# EAGLE design control_system (EAGLE 9.5.1)
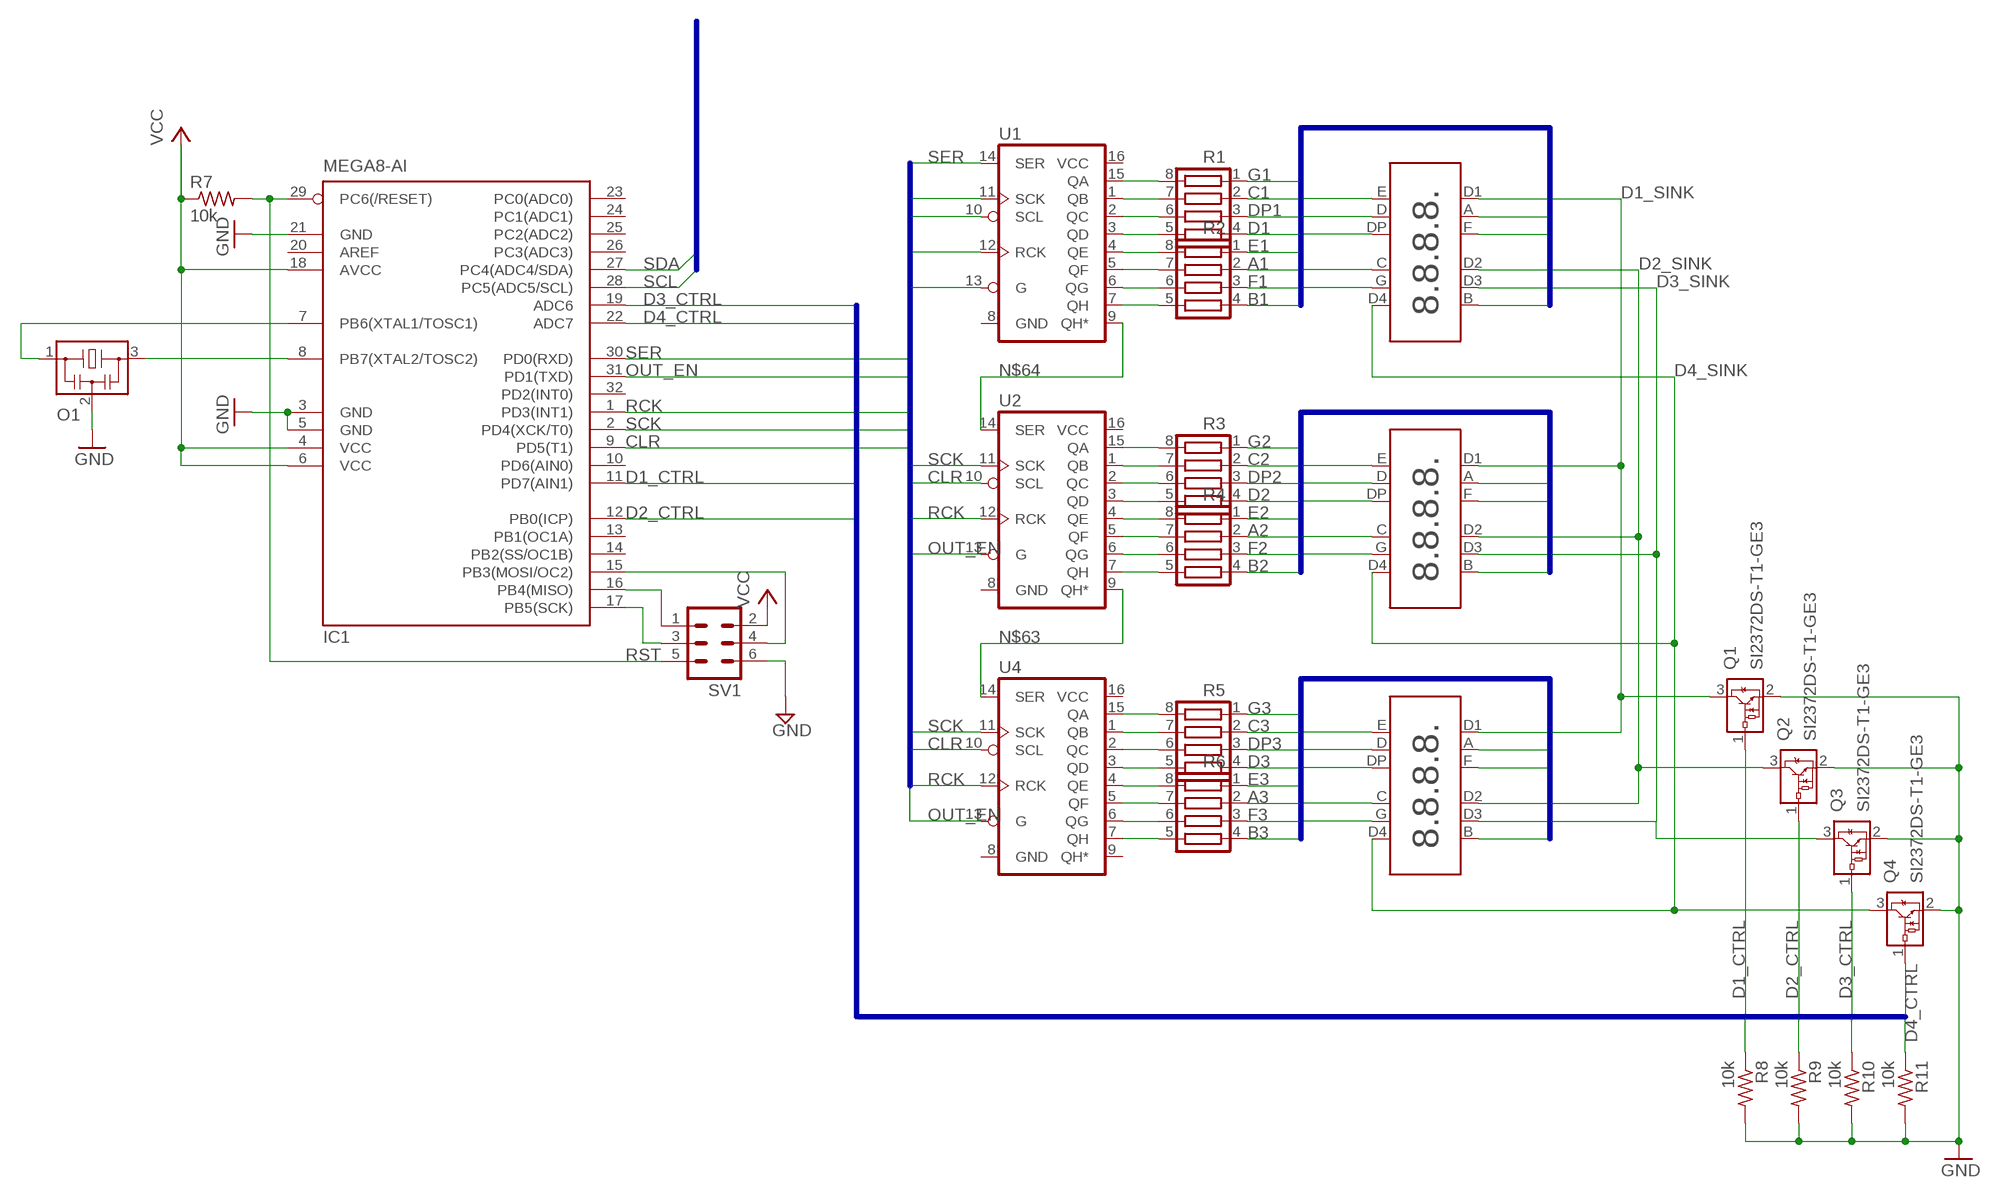
[diagram p0: schematic, sheet 1]

## Parts
IC1  MEGA8-AI  [TQFP32-08]
LED1  7SEG20MM  [7SEG20MM]
LED2  7SEG20MM  [7SEG20MM]
LED3  7SEG20MM  [7SEG20MM]
O1  CSTNE16M0V530000R0  [CSTCR6M]
Q1  SI2372DS-T1-GE3  MDC3105LT1  [SOT23]
Q2  SI2372DS-T1-GE3  MDC3105LT1  [SOT23]
Q3  SI2372DS-T1-GE3  MDC3105LT1  [SOT23]
Q4  SI2372DS-T1-GE3  MDC3105LT1  [SOT23]
R1  220  MNR04MRAPJ221MNR04  [RESCAXS50P200X150X50-8N]
R2  220  MNR04MRAPJ221MNR04  [RESCAXS50P200X150X50-8N]
R3  220  MNR04MRAPJ221MNR04  [RESCAXS50P200X150X50-8N]
R4  220  MNR04MRAPJ221MNR04  [RESCAXS50P200X150X50-8N]
R5  220  MNR04MRAPJ221MNR04  [RESCAXS50P200X150X50-8N]
R6  220  MNR04MRAPJ221MNR04  [RESCAXS50P200X150X50-8N]
R7  10k  R-US_R0402  [R0402]
R8  10k  R-US_R0402  [R0402]
R9  10k  R-US_R0402  [R0402]
R10  10k  R-US_R0402  [R0402]
R11  10k  R-US_R0402  [R0402]
SV1  MA03-2  [MA03-2]
U1  74595  [TSSOP16]
U2  74595  [TSSOP16]
U4  74595  [TSSOP16]

## Nets
A1: LED1.A R2.2
A2: LED2.A R4.2
A3: LED3.A R6.2
B1: LED1.B R2.4
B2: LED2.B R4.4
B3: LED3.B R6.4
C1: LED1.C R1.2
C2: LED2.C R3.2
C3: LED3.C R5.2
CLR: IC1.9(PD5(T1)) U1.10(SCL) U2.10(SCL) U4.10(SCL)
D1: LED1.D R1.4
D1_CTRL: IC1.11(PD7(AIN1)) Q1.1(VIN) R8.1
D1_SINK: LED1.D1 LED2.D1 LED3.D1 Q1.3(VOUT)
D2: LED2.D R3.4
D2_CTRL: IC1.12(PB0(ICP)) Q2.1(VIN) R9.1
D2_SINK: LED1.D2 LED2.D2 LED3.D2 Q2.3(VOUT)
D3: LED3.D R5.4
D3_CTRL: IC1.19(ADC6) Q3.1(VIN) R10.1
D3_SINK: LED1.D3 LED2.D3 LED3.D3 Q3.3(VOUT)
D4_CTRL: IC1.22(ADC7) Q4.1(VIN) R11.1
D4_SINK: LED1.D4 LED2.D4 LED3.D4 Q4.3(VOUT)
DP1: LED1.DP R1.3
DP2: LED2.DP R3.3
DP3: LED3.DP R5.3
E1: LED1.E R2.1
E2: LED2.E R4.1
E3: LED3.E R6.1
F1: LED1.F R2.3
F2: LED2.F R4.3
F3: LED3.F R6.3
G1: LED1.G R1.1
G2: LED2.G R3.1
G3: LED3.G R5.1
GND: IC1.3(GND) IC1.5(GND) IC1.21(GND) O1.2 Q1.2(GND) Q2.2(GND) Q3.2(GND) Q4.2(GND) R8.2 R9.2 R10.2 R11.2 SV1.6
MISO: IC1.16(PB4(MISO)) SV1.1
MOSI: IC1.15(PB3(MOSI/OC2)) SV1.4
N$1: R1.8 U1.15(QA)
N$2: R1.7 U1.1(QB)
N$3: R1.6 U1.2(QC)
N$4: R1.5 U1.3(QD)
N$5: R2.8 U1.4(QE)
N$6: R2.7 U1.5(QF)
N$7: R2.6 U1.6(QG)
N$8: R2.5 U1.7(QH)
N$17: IC1.7(PB6(XTAL1/TOSC1)) O1.1
N$18: IC1.8(PB7(XTAL2/TOSC2)) O1.3
N$23: R3.8 U2.15(QA)
N$24: R3.7 U2.1(QB)
N$25: R3.6 U2.2(QC)
N$26: R3.5 U2.3(QD)
N$27: R4.8 U2.4(QE)
N$28: R4.7 U2.5(QF)
N$29: R4.6 U2.6(QG)
N$30: R4.5 U2.7(QH)
N$43: R5.8 U4.15(QA)
N$44: R5.7 U4.1(QB)
N$45: R5.6 U4.2(QC)
N$46: R5.5 U4.3(QD)
N$47: R6.8 U4.4(QE)
N$48: R6.7 U4.5(QF)
N$49: R6.6 U4.6(QG)
N$50: R6.5 U4.7(QH)
N$63: U2.9(QH*) U4.14(SER)
N$64: U1.9(QH*) U2.14(SER)
OUT_EN: IC1.31(PD1(TXD)) U1.13(G) U2.13(G) U4.13(G)
RCK: IC1.1(PD3(INT1)) U1.12(RCK) U2.12(RCK) U4.12(RCK)
RST: IC1.29(PC6(/RESET)) R7.2 SV1.5
SCK: IC1.2(PD4(XCK/T0)) U1.11(SCK) U2.11(SCK) U4.11(SCK)
SCK1: IC1.17(PB5(SCK)) SV1.3
SCL: IC1.28(PC5(ADC5/SCL))
SDA: IC1.27(PC4(ADC4/SDA))
SER: IC1.30(PD0(RXD)) U1.14(SER)
VCC: IC1.4(VCC) IC1.6(VCC) IC1.18(AVCC) R7.1 SV1.2
Unconnected: IC1.10(PD6(AIN0)) IC1.13(PB1(OC1A)) IC1.14(PB2(SS/OC1B)) IC1.20(AREF) IC1.23(PC0(ADC0)) IC1.24(PC1(ADC1)) IC1.25(PC2(ADC2)) IC1.26(PC3(ADC3)) IC1.32(PD2(INT0)) U4.9(QH*)

## Buses
I2C:SCL,SDA
CLR,OUT_EN,RCK,SCK,SER
D1_CTRL,D2_CTRL,D3_CTRL,D4_CTRL
A1,B1,C1,D1,DP1,E1,F1,G1
A2,B2,C2,D2,DP2,E2,F2,G2
A3,B3,C3,D3,DP3,E3,F3,G3

## Power pins joined to a net without a drawn wire
GND: U1.8(GND) U2.8(GND) U4.8(GND)
VCC: U1.16(VCC) U2.16(VCC) U4.16(VCC)

## Library data of the parts
IC1 = atmel:MEGA8: MICROCONTROLLER 8 Kbytes FLASH, 1 kbytes SRAM, 512 bytes EEPROM, USART, 6-channel 10 bit ADC, 2-channel 8 bit ADC Pin compatible with Atmega48, ATMega88, ATMega168 Source: avr.lbr; MPN: ATMEGA8-16AU; OC_FARNELL: 9171371; OC_NEWARK: 73M8863
LED1-LED3 = diy-modules:7SEG20MM: 7 Segment Display, 20mm digits
O1 = murata-resonators:CSTNE16M0V530000R0
Q1-Q4 = on-semiconductor:MDC3105LT1: Integrated Relay, Inductive Load Driver Sopurce: U6 OnSemi Inductive Load Driver MDC3105-D.PDF; MF: ON SEMICONDUCTOR; MPN: MDC3105LT1; OC_FARNELL: 1126459; OC_NEWARK: 16F6132
R1-R6 = MNR04MRAPJ221:MNR04MRAPJ221
R7-R11 = rcl:R-US_: RESISTOR, American symbol; SPICEPREFIX: R
SV1 = con-lstb:MA03-2: PIN HEADER; OC_FARNELL: unknown; OC_NEWARK: unknown
U1 U2 U4 = SparkFun-IC-Logic:74*595: 8-Bit Shift Register (Serial to Parallel) Datasheet <http://cdn.sparkfun.com/datasheets/BreakoutBoards/MM74HC595.pdf> SparkFun Products SparkFun Shift Register Breakout - 74HC595 <https://www.sparkfun.com/products/10680> (BOB-10680)

## Board
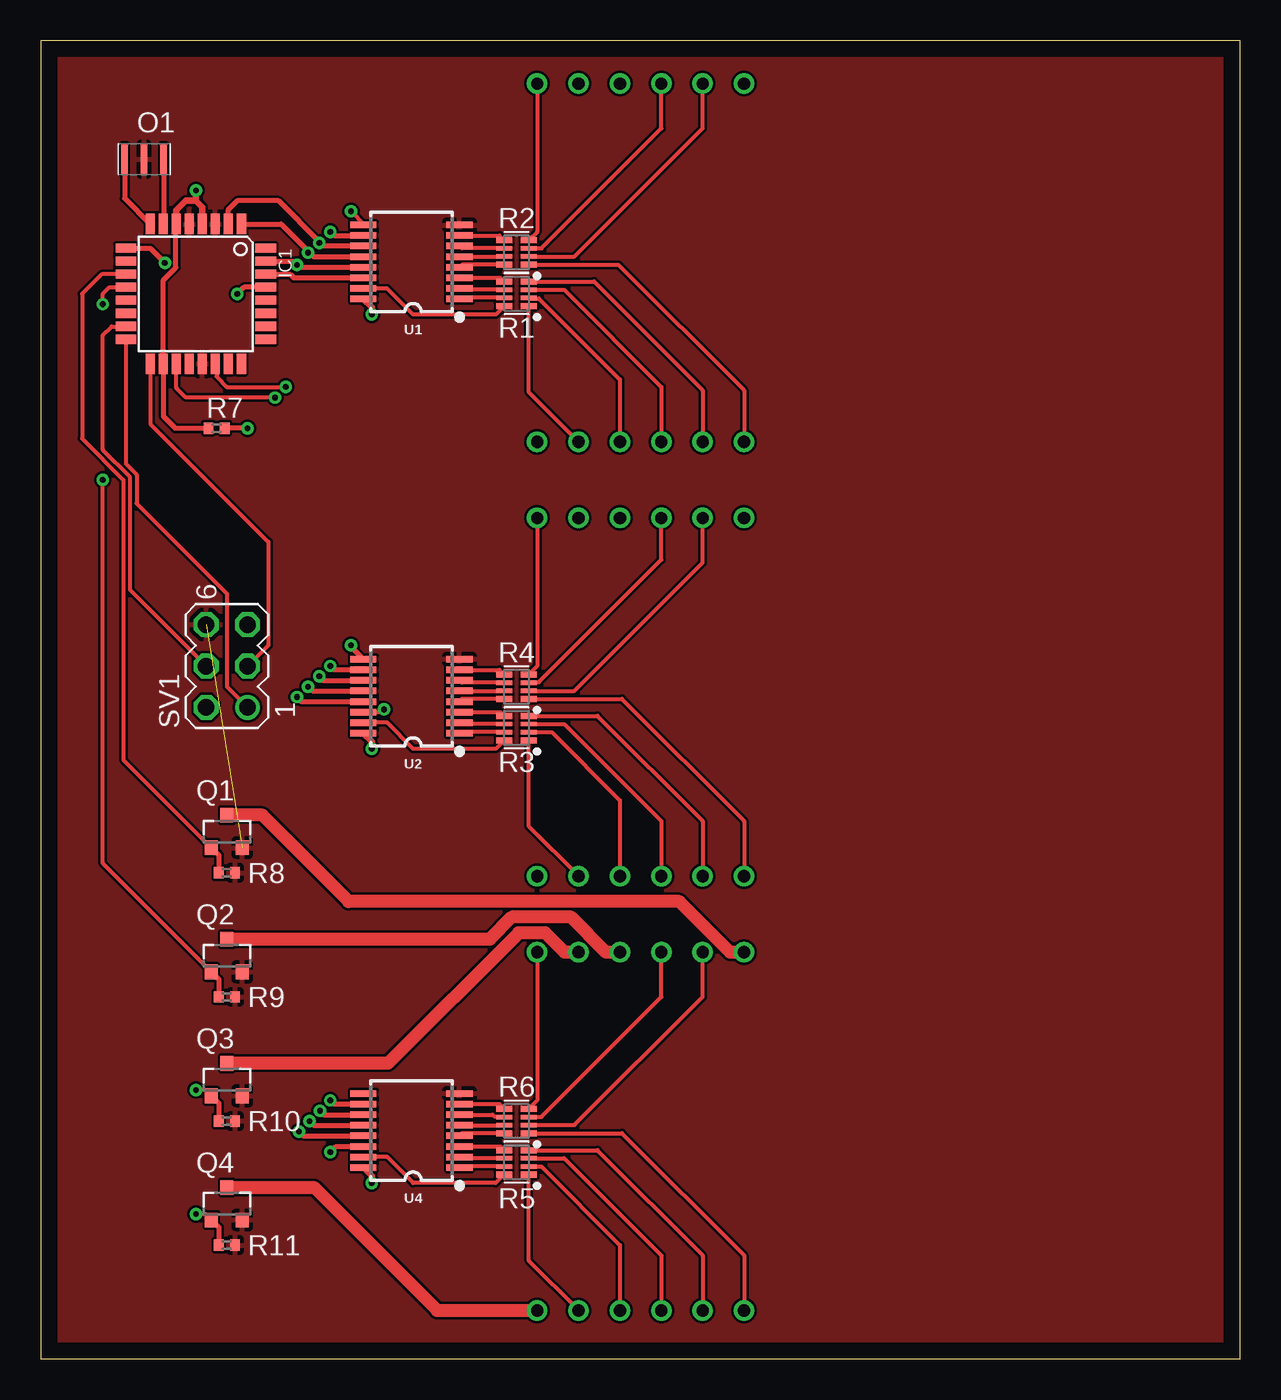
[diagram p1: board, top side]
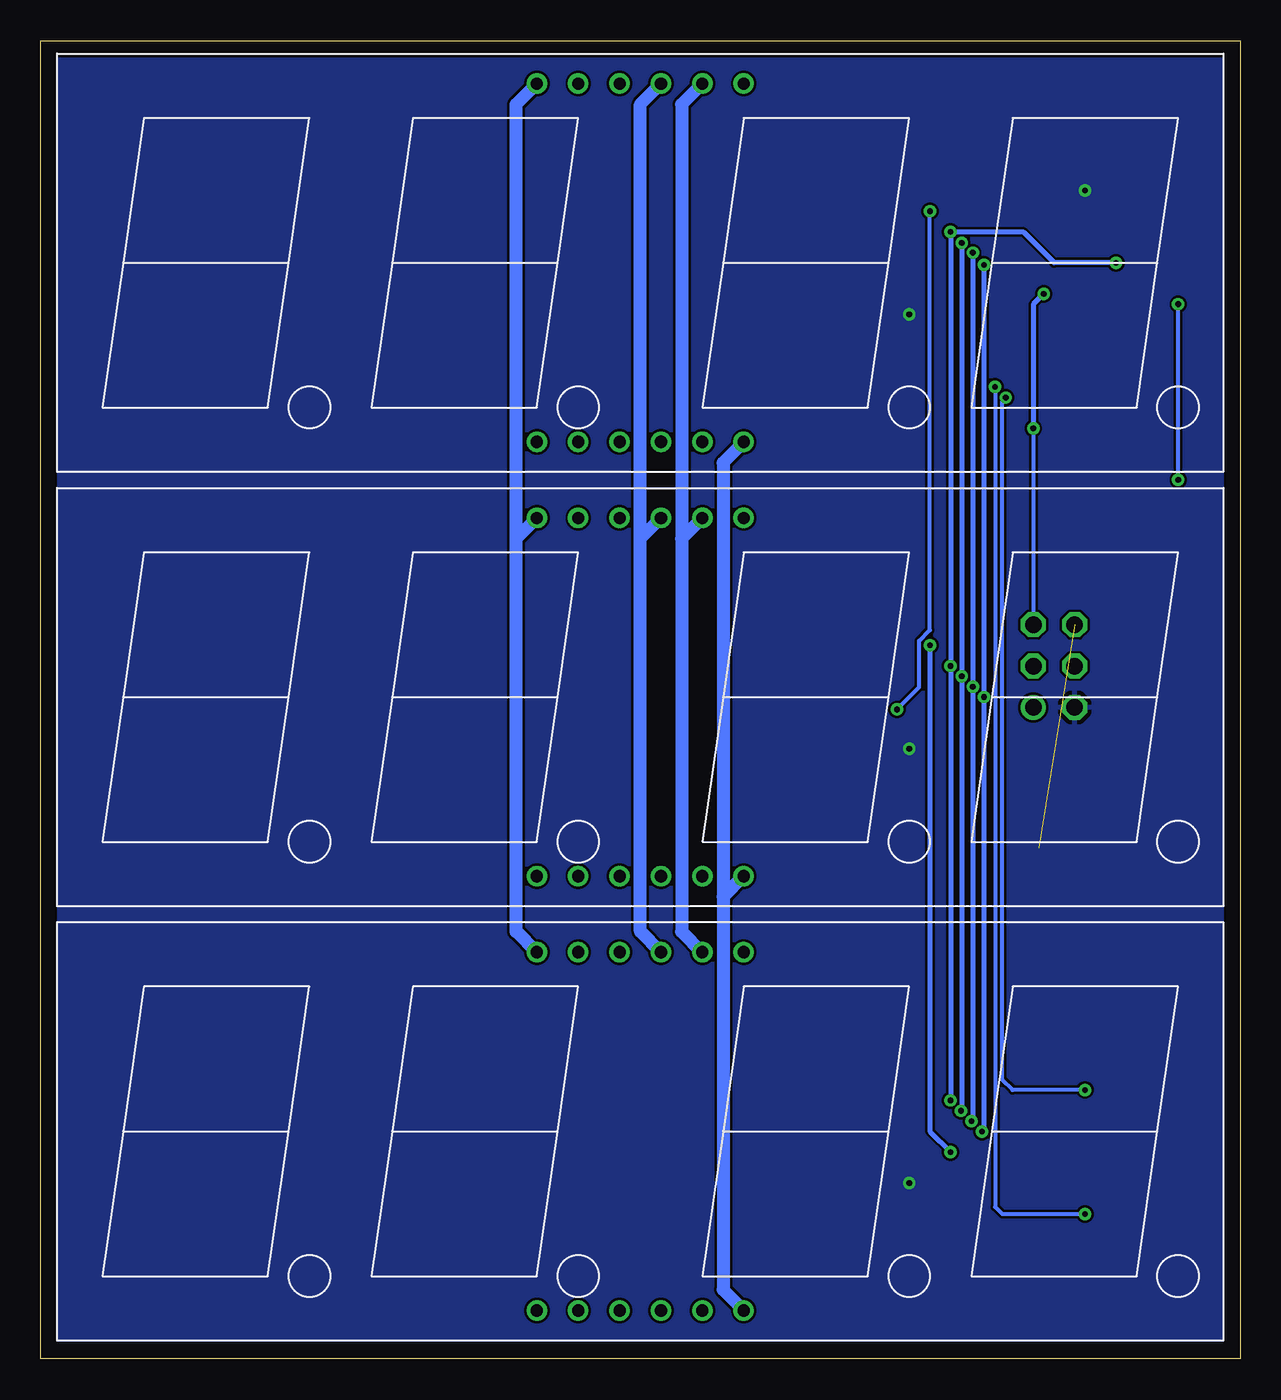
[diagram p2: board, bottom side, seen from below]

Size 73.64 x 80.95 mm. Coordinates in mm from the lower left corner, seen from the top.
Outline: 0,0 73.64,0 73.64,80.95 0,80.95 0,0
Copper layers (1*16): Top 0.035mm / dielectric 1.5mm / Bottom 0.035mm
Design rules "default": minimum track width 6mil, minimum drill 0.35mm, track to track 6mil, track to pad 6mil, pad to pad 6mil, via to via 6mil, smd to smd 6mil, copper to edge 40mil, drill to drill 6mil, minimum pad ring 10mil, minimum via ring 8mil, stop-mask expansion 4mil, vias tented up to drill 0mil, thermal gap 10mil

### Footprints (pad centres in the part's own frame; a part is rotated, then mirrored left to right if it is on the bottom)
TQFP32-08 = smd 1.27 x 0.559: 1 -4.293,2.8; 2 -4.293,2; 3 -4.293,1.2; 4 -4.293,0.4; 5 -4.293,-0.4; 6 -4.293,-1.2; 7 -4.293,-2; 8 -4.293,-2.8; 17 4.293,-2.8; 18 4.293,-2; 19 4.293,-1.2; 20 4.293,-0.4; 21 4.293,0.4; 22 4.293,1.2; 23 4.293,2; 24 4.293,2.8 | smd 0.559 x 1.27: 9 -2.8,-4.293; 10 -2,-4.293; 11 -1.2,-4.293; 12 -0.4,-4.293; 13 0.4,-4.293; 14 1.2,-4.293; 15 2,-4.293; 16 2.8,-4.293; 25 2.8,4.293; 26 2,4.293; 27 1.2,4.293; 28 0.4,4.293; 29 -0.4,4.293; 30 -1.2,4.293; 31 -2,4.293; 32 -2.8,4.293
7SEG20MM = drill 0.75: A -3.81,11; B 6.35,11; C 1.27,-11; D -3.81,-11; D1 -6.35,11; D2 1.27,11; D3 3.81,11; D4 6.35,-11; DP -1.27,-11; E -6.35,-11; F -1.27,11; G 3.81,-11
CSTCR6M = smd 0.4 x 1.9: 1 -1.2,0; 2 0,0; 3 1.2,0
SOT23 = smd 0.8 x 0.9: 1 -0.95,-1; 2 0.95,-1; 3 0,1
RESCAXS50P200X150X50-8N = smd 0.992 x 0.372: 1 -0.76,0.75; 4 -0.76,-0.75; 5 0.76,-0.75; 8 0.76,0.75 | smd 0.992 x 0.272: 2 -0.76,0.25; 3 -0.76,-0.25; 6 0.76,-0.25; 7 0.76,0.25
R0402 = smd 0.6 x 0.7: 1 -0.5,0; 2 0.5,0
MA03-2 = drill 1.016: 1 -2.54,-1.27 | drill 1.016 octagon: 2 -2.54,1.27; 3 0,-1.27; 4 0,1.27; 5 2.54,-1.27; 6 2.54,1.27
TSSOP16 = smd 0.4 x 1.6: 1 -2.225,-2.85; 2 -1.575,-2.85; 3 -0.925,-2.85; 4 -0.275,-2.85; 5 0.375,-2.85; 6 1.025,-2.85; 7 1.675,-2.85; 8 2.325,-2.85; 9 2.325,3.05; 10 1.675,3.05; 11 1.025,3.05; 12 0.375,3.05; 13 -0.275,3.05; 14 -0.925,3.05; 15 -1.575,3.05; 16 -2.225,3.05

### Placement (x,y rotation side)
IC1  9.53,65.41 270 top
LED1  36.83,67.31 0 bottom
LED2  36.83,40.64 0 bottom
LED3  36.83,13.97 0 bottom
O1  6.35,73.66 180 top
Q1  11.43,32.38 0 top
Q2  11.43,24.77 0 top
Q3  11.43,17.14 0 top
Q4  11.43,9.53 0 top
R1  29.21,65.41 180 top
R2  29.21,67.94 180 top
R3  29.21,38.73 180 top
R4  29.21,41.27 180 top
R5  29.21,12.06 180 top
R6  29.21,14.61 180 top
R7  10.79,57.15 0 top
R8  11.43,29.84 0 top
R9  11.43,22.23 0 top
R10  11.43,14.61 0 top
R11  11.43,6.99 0 top
SV1  11.43,42.55 90 top
U1  22.86,67.31 90 top
U2  22.86,40.64 90 top
U4  22.86,13.97 90 top

### Tracks (layer width: path | path; a pad name or v marks a point on that pad's centre or on a via)
A1
  Top 0.254: R2.2 32.77,67.69 40.64,75.56 LED1.A
A2
  Top 0.254: R4.2 32.77,41.02 40.64,48.9 LED2.A
A3
  Top 0.254: R6.2 32.77,14.36 40.64,22.23 LED3.A
B1
  Top 0.254: LED1.B 30.48,69.2 R2.4
B2
  Top 0.254: LED2.B 30.48,42.53 R4.4
B3
  Top 0.254: LED3.B 30.48,15.87 R6.4
C1
  Top 0.254: R1.2 30,65.12 30.58,65.12 35.56,60.14 LED1.C
C2
  Top 0.254: R3.2 31.36,38.48 35.56,34.29 LED2.C
C3
  Top 0.254: R5.2 30.73,11.81 35.56,6.99 LED3.C
CLR  (via drill 0.35)
  Top 0.305: IC1.9 6.72,68.2 v7.62,67.31 | U1.10 18.01,68.98 v17.78,69.22 | v17.78,15.88 18.01,15.64 U4.10 | U2.10 18.01,42.31 v17.78,42.55
  Bottom 0.305: v7.62,67.31 11.43,67.31 13.34,69.22 v17.78,69.22 v17.78,42.55 v17.78,15.88
D1
  Top 0.254: R1.4 33.97,66.16 40.64,59.48 LED1.D
D1_CTRL
  Top 0.254: IC1.11 3.74,66.61 2.54,65.41 2.54,56.52 5.08,53.98 5.08,36.78 Q1.1
  Top 0.305: Q1.1 10.93,30.93 R8.1
D1_SINK
  Top 0.813: LED3.D1 42.32,24.97 39.2,28.09 18.9,28.09 13.61,33.38 Q1.3
  Bottom 0.813: LED3.D1 44.45,26.24 44.45,50.37 | LED1.D1 44.45,77.04 44.45,50.37 | LED2.D1 44.45,50.37
D2
  Top 0.254: R3.4 34.17,39.48 40.64,33.02 LED2.D
D2_CTRL  (via drill 0.35)
  Top 0.254: Q2.1 3.81,30.43 v3.81,53.98 | v3.81,64.77 3.81,65.41 4.21,65.81 IC1.12
  Top 0.305: Q2.1 10.93,23.32 R9.1
  Bottom 0.254: v3.81,53.98 v3.81,64.77
D2_SINK
  Top 0.813: LED3.D2 34.7,24.97 32.55,27.12 28.93,27.12 27.57,25.77 Q2.3
  Bottom 0.813: LED3.D2 36.83,26.24 36.83,50.37 | LED1.D2 36.83,77.04 36.83,50.37 | LED2.D2 36.83,50.37
D3
  Top 0.254: R5.4 34.17,12.81 40.64,6.35 LED3.D
D3_CTRL  (via drill 0.35)
  Top 0.254: Q3.1 10.12,16.51 v9.53,16.51 | v14.39,59.03 8.91,59.03 8.32,59.62 IC1.19
  Top 0.305: Q3.1 10.93,15.7 R10.1
  Bottom 0.254: v9.53,16.51 13.97,16.51 14.61,17.14 14.61,58.82 v14.39,59.03
D3_SINK
  Top 0.813: LED3.D3 32.16,24.97 30.97,26.16 29.33,26.16 21.32,18.14 Q3.3
  Bottom 0.813: LED1.D3 34.29,77.04 34.29,50.37 | LED3.D3 34.29,26.24 34.29,50.37 | LED2.D3 34.29,50.37
D4_CTRL  (via drill 0.35)
  Top 0.254: IC1.22 10.79,61.04 10.79,60.33 11.43,59.69 v15.05,59.69 | v9.53,8.89 10.12,8.89 Q4.1
  Top 0.305: Q4.1 10.93,8.07 R11.1
  Bottom 0.254: v15.05,59.69 15.05,9.33 14.61,8.89 v9.53,8.89
D4_SINK
  Top 0.813: Q4.3 16.78,10.53 24.34,2.97 LED3.D4
  Bottom 0.813: LED1.D4 31.75,55.04 31.75,28.37 | LED3.D4 31.75,4.24 31.75,28.37 | LED2.D4 31.75,28.37
DP1
  Top 0.254: R1.3 32.13,65.66 38.1,59.69 LED1.DP
DP2
  Top 0.254: R3.3 32.13,38.98 38.1,33.02 LED2.DP
DP3
  Top 0.254: R5.3 32.13,12.31 38.1,6.35 LED3.DP
E1
  Top 0.254: R2.1 35.47,67.19 43.18,59.48 LED1.E
E2
  Top 0.254: R4.1 35.67,40.52 43.18,33.02 LED2.E
E3
  Top 0.254: R6.1 35.67,13.86 43.18,6.35 LED3.E
F1
  Top 0.254: R2.3 30.73,68.19 38.1,75.56 LED1.F
F2
  Top 0.254: R4.3 30,41.56 30.58,41.56 38.1,49.08 LED2.F
F3
  Top 0.254: R6.3 30.73,14.86 38.1,22.23 LED3.F
G1
  Top 0.254: LED1.G 29.97,59.36 R1.1
G2
  Top 0.254: LED2.G 29.97,32.69 R3.1
G3
  Top 0.254: LED3.G 29.97,6.02 R5.1
GND  (1 unrouted)
  pour Top: -1.27,81.92 -1.27,-1.27 76.2,-1.27 76.2,81.92 75.56,82.55 -0.64,82.55
MISO
  Top 0.254: IC1.16 5.23,54.97 5.89,54.31 5.89,52.53 11.43,46.99 11.43,41.27 SV1.1
MOSI
  Top 0.254: SV1.4 5.49,47.22 5.49,54.14 3.81,55.82 3.81,62.87 4.35,63.41 IC1.15
N$1
  Top 0.254: R1.8 27.93,64.14 22.86,64.14 21.26,65.73 U1.15
N$2
  Top 0.254: R1.7 25.78,65.16 U1.1
N$3
  Top 0.254: R1.6 25.79,65.66 U1.2
N$4
  Top 0.254: U1.3 28.22,66.39 R1.5
N$5
  Top 0.254: R2.8 25.87,67.19 U1.4
N$6
  Top 0.254: U1.5 R2.7
N$7
  Top 0.254: R2.6 25.85,68.19 U1.6
N$8
  Top 0.254: U1.7 28.16,68.98 R2.5
N$17
  Top 0.305: O1.1 7.55,69.72 IC1.7
N$18
  Top 0.305: O1.3 5.15,71.27 IC1.8
N$23
  Top 0.254: R3.8 27.93,37.47 22.86,37.47 21.26,39.06 U2.15
N$24
  Top 0.254: R3.7 25.78,38.48 U2.1
N$25
  Top 0.254: R3.6 25.79,38.98 U2.2
N$26
  Top 0.254: U2.3 28.22,39.72 R3.5
N$27
  Top 0.254: R4.8 25.87,40.52 U2.4
N$28
  Top 0.254: U2.5 R4.7
N$29
  Top 0.254: R4.6 25.85,41.52 U2.6
N$30
  Top 0.254: U2.7 28.16,42.31 R4.5
N$43
  Top 0.254: R5.8 27.93,10.79 22.86,10.79 21.26,12.39 U4.15
N$44
  Top 0.254: R5.7 25.78,11.81 U4.1
N$45
  Top 0.254: R5.6 25.79,12.31 U4.2
N$46
  Top 0.254: U4.3 28.22,13.04 R5.5
N$47
  Top 0.254: R6.8 25.87,13.86 U4.4
N$48
  Top 0.254: U4.5 28.44,14.35 R6.7
N$49
  Top 0.254: U4.6 27.73,14.99 27.84,14.89 28.41,14.89 R6.6
N$50
  Top 0.254: U4.7 28.16,15.64 R6.5
N$63  (via drill 0.35)
  Top 0.305: U2.9 19.05,43.73 v19.05,43.81 | v17.78,12.7 18.12,13.04 U4.14
  Bottom 0.305: v19.05,43.81 19.05,13.97 v17.78,12.7
N$64  (via drill 0.35)
  Top 0.254: U2.14 20.91,39.72 v21.08,39.88 | v19.05,70.48 19.81,69.72 U1.9
  Bottom 0.254: v19.05,70.48 19.05,44.74 19.71,44.09 19.71,41.25 v21.08,39.88
OUT_EN  (via drill 0.35)
  Top 0.305: IC1.31 15.53,67.41 15.75,67.18 | U1.13 15.9,67.03 15.75,67.18 | 15.75,67.18 v15.73,67.18 | v15.73,40.64 16.01,40.37 U2.13 | v15.85,13.95 16.1,13.7 U4.13
  Bottom 0.305: v15.73,67.18 v15.73,40.64 15.73,14.07 v15.85,13.95
RCK  (via drill 0.35)
  Top 0.305: IC1.1 14.76,69.7 16.51,67.94 | U1.12 16.77,67.69 16.51,67.94 | 16.51,67.94 16.5,67.93 v16.41,67.93 | v16.41,41.27 16.67,41.02 U2.12 | v16.5,14.59 16.74,14.35 U4.12
  Bottom 0.305: v16.41,67.93 v16.41,41.27 16.41,14.67 v16.5,14.59
RST  (via drill 0.35)
  Top 0.305: IC1.29 12.46,65.81 v12.06,65.41 | v12.7,57.15 R7.2
  Bottom 0.254: v12.7,57.15 SV1.5
  Bottom 0.305: v12.06,65.41 12.7,64.77 v12.7,57.15
SCK  (via drill 0.35)
  Top 0.305: IC1.2 11.53,70.58 12.06,71.12 14.61,71.12 17.14,68.58 | U1.11 17.39,68.33 17.14,68.58 | 17.14,68.58 v17.1,68.53 | v17.1,41.91 17.34,41.66 U2.11 | v17.14,15.23 17.38,14.99 U4.11
  Bottom 0.305: v17.1,68.53 v17.1,41.91 17.1,15.27 v17.14,15.23
SCK1
  Top 0.254: IC1.17 6.72,57.41 13.97,50.16 13.97,43.81 SV1.3
SER
  Top 0.305: IC1.30 15.31,66.61 15.53,66.39 U1.14
VCC  (via drill 0.35)
  Top 0.305: R7.1 8.26,57.15 7.53,57.88 IC1.18 7.53,66.25 8.3,67.03 8.3,69.68 IC1.6
  Top 0.406: U2.16 20.32,37.91 v20.32,37.47 | U4.16 20.32,11.23 v20.32,10.79 | U1.16 20.32,64.58 v20.32,64.14 | IC1.6 8.32,70.56 8.89,71.12 9.53,71.12 | 9.53,71.12 9.93,70.72 IC1.4 | 9.53,71.12 v9.53,71.75
  pour Bottom: -1.27,85.09 -1.27,-5.08 79.38,-5.08 86.36,1.91 86.36,85.09